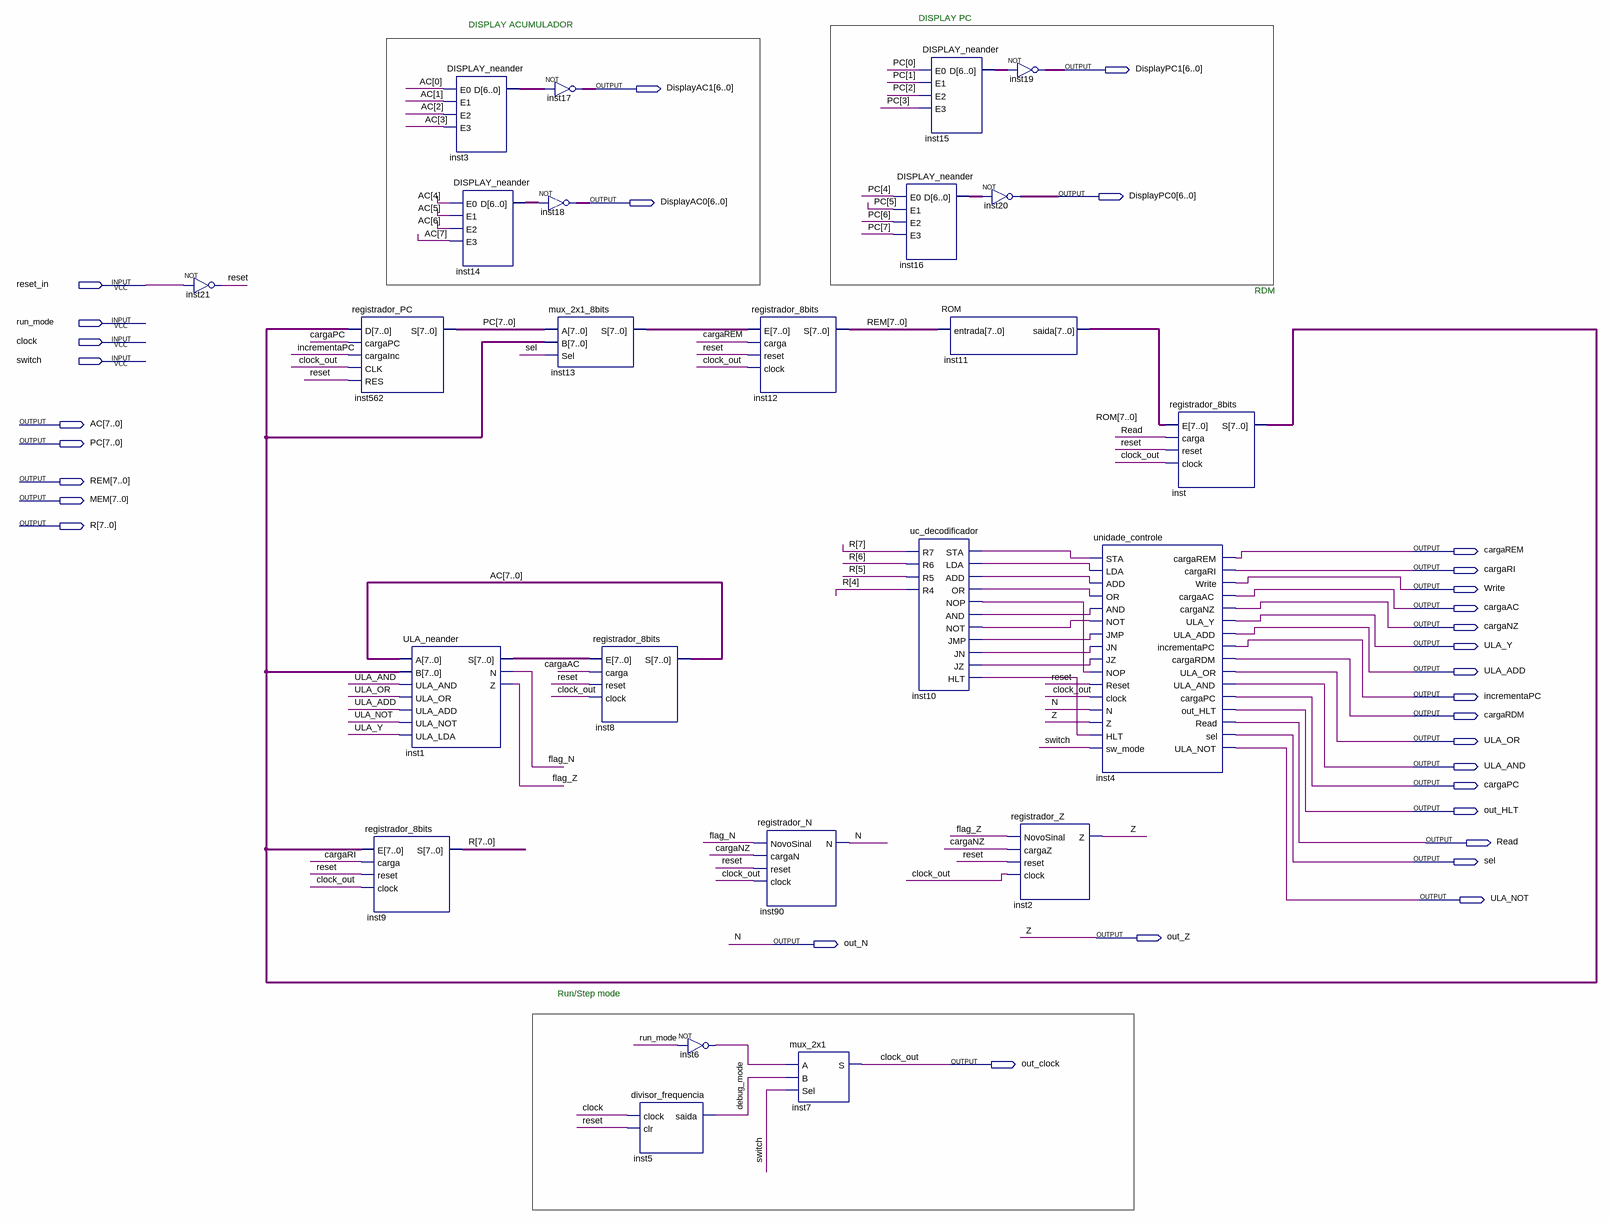
[diagram p0: schematic sheet]
// Quartus schematic Neander.bdf as structural Verilog: 24 symbols, 32 pins
module Neander (
  input  reset_in,
  input  run_mode,
  input  clock,
  input  switch,
  output [6:0] DisplayPC1,
  output [6:0] DisplayAC1,
  output [6:0] DisplayPC0,
  output [6:0] DisplayAC0,
  output [7:0] AC,
  output [7:0] PC,
  output [7:0] REM,
  output [7:0] MEM,
  output [7:0] R,
  output cargaREM,
  output cargaRI,
  output Write,
  output cargaAC,
  output cargaNZ,
  output ULA_Y,
  output ULA_ADD,
  output incrementaPC,
  output cargaRDM,
  output ULA_OR,
  output ULA_AND,
  output cargaPC,
  output out_HLT,
  output Read,
  output sel,
  output ULA_NOT,
  output out_Z,
  output out_N,
  output out_clock
);

  wire debug_mode, flag_N, flag_Z, inst6_out, inst10_add, inst10_and, inst10_hlt, inst10_jmp, inst10_jn,
       inst10_jz, inst10_lda, inst10_nop, inst10_not, inst10_or, inst10_sta, reset;
  wire [6:0] inst3_d, inst14_d, inst15_d, inst16_d;
  wire [7:0] inst1_s, inst13_s, inst_s, ROM;

  not inst21 (reset, reset_in);
  registrador_PC inst562 (.D(inst_s), .cargaPC(cargaPC), .cargaInc(incrementaPC), .CLK(out_clock), .RES(reset), .S(PC));
  registrador_8bits inst9 (.E(inst_s), .carga(cargaRI), .reset(reset), .clock(out_clock), .S(R));
  ULA_neander inst1 (
    .A(AC), .B(inst_s), .ULA_AND(ULA_AND), .ULA_OR(ULA_OR), .ULA_ADD(ULA_ADD), .ULA_NOT(ULA_NOT),
    .ULA_LDA(ULA_Y), .S(inst1_s), .N(flag_N), .Z(flag_Z));
  DISPLAY_neander inst3 (.E0(AC[0]), .E1(AC[1]), .E2(AC[2]), .E3(AC[3]), .D(inst3_d));
  DISPLAY_neander inst14 (.E0(AC[4]), .E1(AC[5]), .E2(AC[6]), .E3(AC[7]), .D(inst14_d));
  assign DisplayAC1 = ~inst3_d;  // NOT inst17, 7 bits wide
  assign DisplayAC0 = ~inst14_d;  // NOT inst18, 7 bits wide
  mux_2x1_8bits inst13 (.A(PC), .B(inst_s), .Sel(sel), .S(inst13_s));
  registrador_8bits inst8 (.E(inst1_s), .carga(cargaAC), .reset(reset), .clock(out_clock), .S(AC));
  divisor_frequencia inst5 (.clock(clock), .clr(reset), .saida(debug_mode));
  not inst6 (inst6_out, run_mode);
  registrador_8bits inst12 (.E(inst13_s), .carga(cargaREM), .reset(reset), .clock(out_clock), .S(REM));
  registrador_N inst90 (.NovoSinal(flag_N), .cargaN(cargaNZ), .reset(reset), .clock(out_clock), .N(out_N));
  mux_2x1 inst7 (.A(inst6_out), .B(debug_mode), .Sel(switch), .S(out_clock));
  DISPLAY_neander inst15 (.E0(PC[0]), .E1(PC[1]), .E2(PC[2]), .E3(PC[3]), .D(inst15_d));
  DISPLAY_neander inst16 (.E0(PC[4]), .E1(PC[5]), .E2(PC[6]), .E3(PC[7]), .D(inst16_d));
  uc_decodificador inst10 (
    .R7(R[7]), .R6(R[6]), .R5(R[5]), .R4(R[4]), .STA(inst10_sta), .LDA(inst10_lda), .ADD(inst10_add),
    .OR(inst10_or), .NOP(inst10_nop), .AND(inst10_and), .NOT(inst10_not), .JMP(inst10_jmp), .JN(inst10_jn),
    .JZ(inst10_jz), .HLT(inst10_hlt));
  ROM inst11 (.entrada(REM), .saida(ROM));
  assign DisplayPC1 = ~inst15_d;  // NOT inst19, 7 bits wide
  assign DisplayPC0 = ~inst16_d;  // NOT inst20, 7 bits wide
  registrador_Z inst2 (.NovoSinal(flag_Z), .cargaZ(cargaNZ), .reset(reset), .clock(out_clock), .Z(out_Z));
  unidade_controle inst4 (
    .STA(inst10_sta), .LDA(inst10_lda), .ADD(inst10_add), .OR(inst10_or), .AND(inst10_and), .NOT(inst10_not),
    .JMP(inst10_jmp), .JN(inst10_jn), .JZ(inst10_jz), .NOP(inst10_nop), .Reset(reset), .clock(out_clock),
    .N(out_N), .Z(out_Z), .HLT(inst10_hlt), .sw_mode(switch), .cargaREM(cargaREM), .cargaRI(cargaRI),
    .Write(Write), .cargaAC(cargaAC), .cargaNZ(cargaNZ), .ULA_Y(ULA_Y), .ULA_ADD(ULA_ADD),
    .incrementaPC(incrementaPC), .cargaRDM(cargaRDM), .ULA_OR(ULA_OR), .ULA_AND(ULA_AND), .cargaPC(cargaPC),
    .out_HLT(out_HLT), .Read(Read), .sel(sel), .ULA_NOT(ULA_NOT));
  registrador_8bits inst (.E(ROM), .carga(Read), .reset(reset), .clock(out_clock), .S(inst_s));

  // Other names for the same wires on the sheet: clock_out = out_clock; N = out_N; Z = out_Z

  // Notes on the sheet:
  //   DISPLAY PC
  //   DISPLAY ACUMULADOR
  //   RDM
  //   Run/Step mode
endmodule
